# EAGLE design Triggy 0.1 (EAGLE 7.4.0)
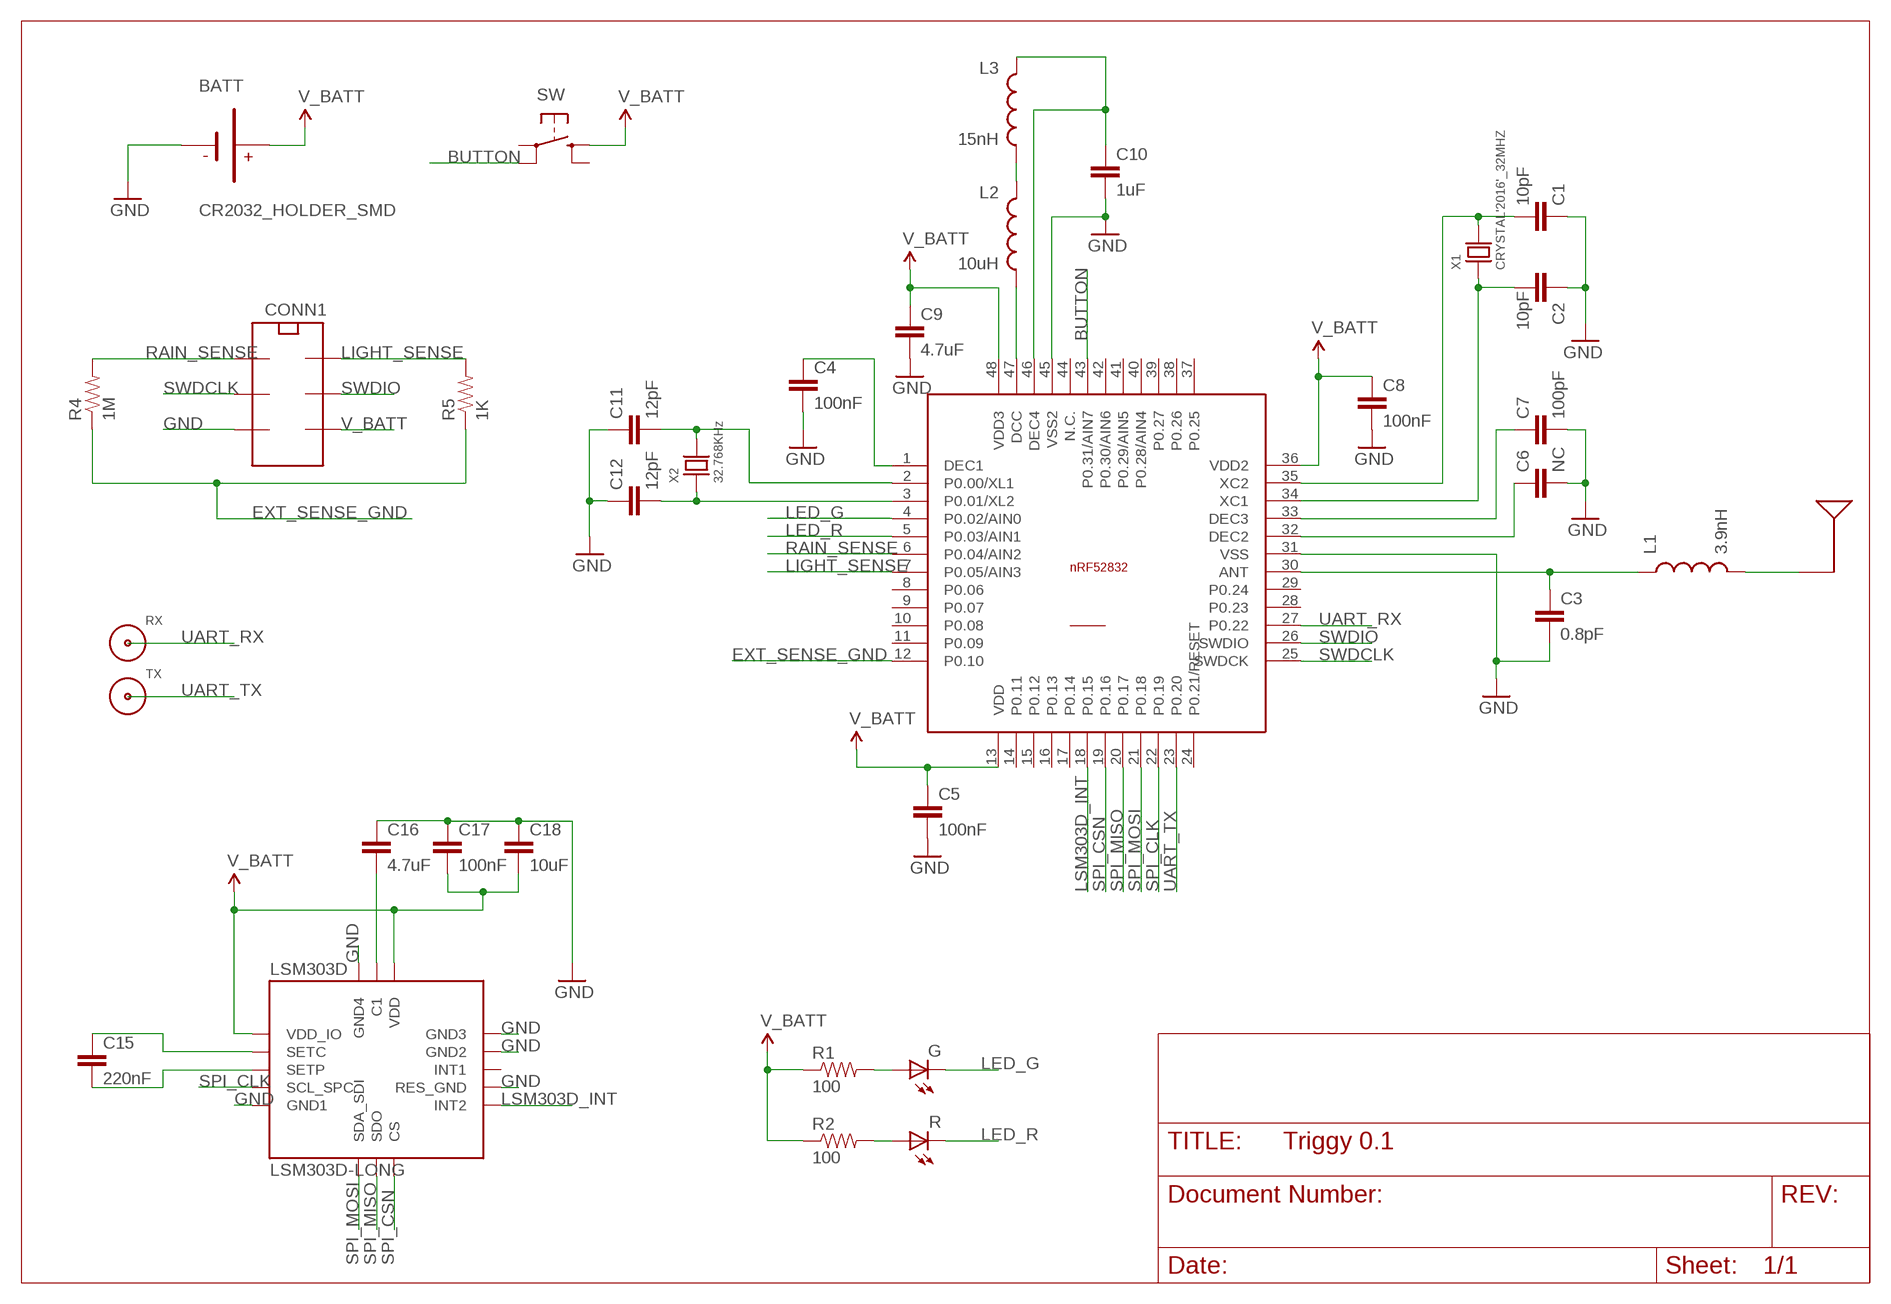
[diagram p0: schematic, sheet 1]

## Parts
ANT  ANTENNA_2450AT43A100  [ANTENNA-SMD-7MM]
BATT  CR2032_HOLDER_SMD  [CR2032_HOLDER_SMD]
C1  10pF  CAP0402-CAP  [0402-CAP]
C2  10pF  CAP0402-CAP  [0402-CAP]
C3  0.8pF  CAP0402-CAP  [0402-CAP]
C4  100nF  CAP0402-CAP  [0402-CAP]
C5  100nF  CAP0402-CAP  [0402-CAP]
C6  NC  CAP0402-CAP  [0402-CAP]
C7  100pF  CAP0402-CAP  [0402-CAP]
C8  100nF  CAP0402-CAP  [0402-CAP]
C9  4.7uF  CAP0603-CAP  [0603-CAP]
C10  1uF  CAP0603-CAP  [0603-CAP]
C11  12pF  CAP0402-CAP  [0402-CAP]
C12  12pF  CAP0402-CAP  [0402-CAP]
C15  220nF  CAP0402-CAP  [0402-CAP]
C16  4.7uF  CAP0603-CAP  [0603-CAP]
C17  100nF  CAP0402-CAP  [0402-CAP]
C18  10uF  CAP0603-CAP  [0603-CAP]
CONN1  MOLEX_8734006XX  [MOLEX_8734006XX]
L1  3.9nH  INDUCTOR0402  [C0402]
L2  10uH  INDUCTOR0603  [0603]
L3  15nH  INDUCTOR0402  [C0402]
LEDS  LED-R-G  [LED-RG-SMD-3X2.5MM]
LSM303D  LSM303D-LONG  [LGA-16-LONG]
NRF52832  NRF52832_QFN  [QFN48]
R1  100  RESISTOR0402  [0402-RES]
R2  100  RESISTOR0402  [0402-RES]
R4  1M  RESISTOR0402  [0402-RES]
R5  1K  RESISTOR0402  [0402-RES]
RX  SINGLE_CONN  [SINGLE-CONN]
SW  SWITCH-PANASONIC  [SWITCH-PANASONIC]
TX  SINGLE_CONN  [SINGLE-CONN]
X1  CRYSTAL'2016'_32MHZ  [X4-SMD-2.0X1.6MM]
X2  32.768KHz  CRYSTAL'3215'  [X2-SMD-3.2X1.5MM]

## Nets
BUTTON: NRF52832.43(P0.31/AIN7) SW.A'
EXT_SENSE_GND: NRF52832.12(P0.10) R4.1 R5.1
GND: BATT.- C1.1 C2.1 C3.2 C4.2 C5.2 C6.2 C7.2 C8.2 C9.2 C10.2 C11.1 C12.1 C16.1 C17.1 C18.1 CONN1.P$5 LSM303D.5(GND1) LSM303D.10(RES_GND) LSM303D.12(GND2) LSM303D.13(GND3) LSM303D.16(GND4) NRF52832.31(VSS) NRF52832.45(VSS2)
LED_G: LEDS.P$4(P4) NRF52832.4(P0.02/AIN0)
LED_R: LEDS.P$2(P2) NRF52832.5(P0.03/AIN1)
LIGHT_SENSE: CONN1.P$2 NRF52832.7(P0.05/AIN3) R5.2
LSM303D_INT: LSM303D.9(INT2) NRF52832.18(P0.15)
N$2: C3.1 L1.1 NRF52832.30(ANT)
N$3: ANT.1 L1.2
N$4: C1.2 NRF52832.35(XC2) X1.4
N$5: C7.1 NRF52832.33(DEC3)
N$6: C4.1 NRF52832.1(DEC1)
N$7: C2.2 NRF52832.34(XC1) X1.2
N$8: C6.1 NRF52832.32(DEC2)
N$9: L2.1 L3.2
N$10: C12.2 NRF52832.3(P0.01/XL2) X2.P$1
N$11: C11.2 NRF52832.2(P0.00/XL1) X2.P$2
N$12: L2.2 NRF52832.47(DCC)
N$15: C10.1 L3.1 NRF52832.46(DEC4)
N$24: LEDS.P$3(P3) R1.2
N$25: LEDS.P$1(P1) R2.2
N$28: C15.1 LSM303D.2(SETC)
N$29: C15.2 LSM303D.3(SETP)
N$32: C16.2 LSM303D.15(C1)
RAIN_SENSE: CONN1.P$1 NRF52832.6(P0.04/AIN2) R4.2
SPI_CLK: LSM303D.4(SCL_SPC) NRF52832.22(P0.19)
SPI_CSN: LSM303D.8(CS) NRF52832.19(P0.16)
SPI_MISO: LSM303D.7(SDO) NRF52832.20(P0.17)
SPI_MOSI: LSM303D.6(SDA_SDI) NRF52832.21(P0.18)
SWDCLK: CONN1.P$3 NRF52832.25(SWDCK)
SWDIO: CONN1.P$4 NRF52832.26(SWDIO)
UART_RX: NRF52832.27(P0.22) RX.1
UART_TX: NRF52832.23(P0.20) TX.1
V_BATT: BATT.+ BATT.+@(+) C5.1 C8.1 C9.1 C17.2 C18.2 CONN1.P$6 LSM303D.1(VDD_IO) LSM303D.14(VDD) NRF52832.13(VDD) NRF52832.36(VDD2) NRF52832.48(VDD3) R1.1 R2.1 SW.B
Unconnected: LSM303D.11(INT1) NRF52832.8(P0.06) NRF52832.9(P0.07) NRF52832.10(P0.08) NRF52832.11(P0.09) NRF52832.14(P0.11) NRF52832.15(P0.12) NRF52832.16(P0.13) NRF52832.17(P0.14) NRF52832.24(P0.21/RESET) NRF52832.28(P0.23) NRF52832.29(P0.24) NRF52832.37(P0.25) NRF52832.38(P0.26) NRF52832.39(P0.27) NRF52832.40(P0.28/AIN4) NRF52832.41(P0.29/AIN5) NRF52832.42(P0.30/AIN6) NRF52832.44(N.C.) NRF52832.GND(SLUG) SW.A SW.B'

## Library data of the parts
ANT = Triggy:ANTENNA_2450AT43A100
BATT = Watchee:CR2032_HOLDER_SMD
C1-C12 C15-C18 = SparkFun-Capacitors:CAP: Capacitor Standard 0603 ceramic capacitor, and 0.1" leaded capacitor.
CONN1 = Triggy:MOLEX_8734006XX
L1-L3 = SparkFun-Passives:INDUCTOR: Inductors Basic Inductor/Choke - 0603 and 1206. Footprints are not proven and vary greatly between part numbers. INDUCTOR POWER 3.3UH 4.0A SMD 0.197" L x 0.197" W x 0.177" H (5.00mm x 5.00mm x 4.50mm)
LEDS = Watchee:LED-R-G
LSM303D = Watchee:LSM303D-LONG
NRF52832 = NordicSemi:NRF52832_QFN
R1 R2 R4 R5 = SparkFun-Resistors:RESISTOR: Resistor Basic schematic elements and footprints for 0603, 1206, and PTH resistors.
RX TX = Watchee:SINGLE_CONN
SW = Watchee:SWITCH-PANASONIC
X1 = Triggy:CRYSTAL'2016'_32MHZ
X2 = Watchee:CRYSTAL'3215'

## Board
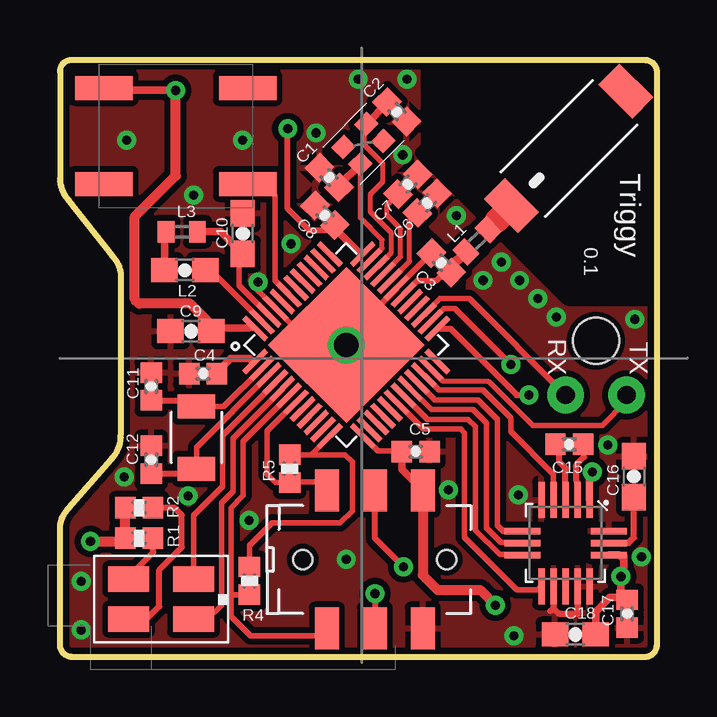
[diagram p1: board, top side]
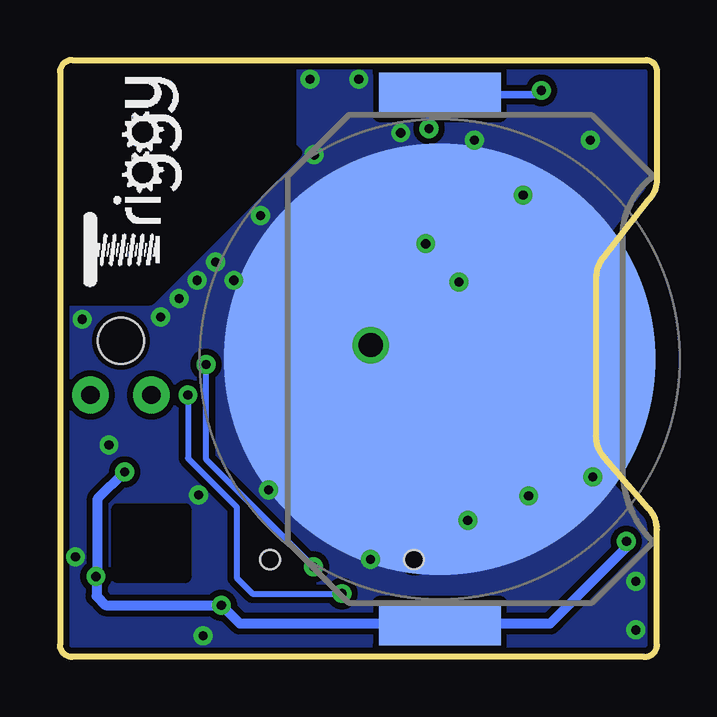
[diagram p2: board, bottom side, seen from below]

Size 24.89 x 24.89 mm. Coordinates in mm from the lower left corner, seen from the top.
Outline: 0.53,0 24.38,0 arc90 24.89,0.51 24.89,24.38 arc90 24.38,24.89 0.46,24.89 arc90 0,24.38 0,19.93 arc45 0.37,19.03 2.17,16.73 arc-45 2.54,15.83 2.54,9.26 arc-45 2.15,8.26 0.37,6.21 arc45 0,5.32 0,0.51 arc90 0.51,0
Copper layers (1*16): Top 0.035mm / dielectric 1mm / Bottom 0.035mm
Design rules "pcb_pool": minimum track width 6mil, minimum drill 8mil, track to track 6mil, track to pad 6mil, pad to pad 6mil, via to via 8mil, smd to smd 6mil, copper to edge 8mil, drill to drill 8mil, minimum pad ring 8mil, minimum via ring 8mil, stop-mask expansion 4mil, vias tented up to drill 20mil, thermal gap 10mil
Holes 1.91 mm at 22.35,13.18
tRestrict: area 15.3,21.3 to 24.9,25.4; area 21.2,14.9 to 25.2,24.5; area 15,14.9 to 28.1,28; 3 lines
bRestrict: area 21.2,14.9 to 25.2,24.5; area 15,14.9 to 28.1,28; area 15.3,21.3 to 24.9,25.4

### Footprints (pad centres in the part's own frame; a part is rotated, then mirrored left to right if it is on the bottom)
ANTENNA-SMD-7MM = smd 1.25 x 2: 1 -3.375,0; 2 3.375,0
CR2032_HOLDER_SMD = smd 1.8 x 5.08: + -11.03,0; +@ 11.03,0 | smd 18 x 18: - 0,0
0402-CAP = smd 0.85 x 0.9: 1 -0.58,0; 2 0.58,0
0603-CAP = smd 1.1 x 1: 1 -0.85,0; 2 0.85,0
MOLEX_8734006XX = smd 1 x 1.75: P$1 -2,-2.875; P$2 -2,2.875; P$3 0,-2.875; P$4 0,2.875; P$5 2,-2.875; P$6 2,2.875 | hole 0.8: -3,0; 3,0
C0402 = smd 0.7 x 0.9: 1 -0.65,0; 2 0.65,0
0603 = smd 1.1 x 1: 1 -0.85,0; 2 0.85,0
LED-RG-SMD-3X2.5MM = smd 1.7 x 1.05: P$1 1.35,0.83; P$2 -1.35,0.83; P$3 1.35,-0.83; P$4 -1.35,-0.83
LGA-16-LONG = smd 1.5 x 0.28: 1 -1.7,1.2; 2 -1.7,0.7; 3 -1.7,0.2; 4 -1.7,-0.3; 5 -1.7,-0.8; 9 1.9,-0.8; 10 1.9,-0.3; 11 1.9,0.2; 12 1.9,0.7; 13 1.9,1.2 | smd 0.28 x 1.5: 6 -0.4,-1.6; 7 0.1,-1.6; 8 0.6,-1.6; 14 0.6,2; 15 0.1,2; 16 -0.4,2
QFN48 = smd 1.3 x 0.226: 1 -3.17,2.2; 2 -3.17,1.8; 3 -3.17,1.4; 4 -3.17,1; 5 -3.17,0.6; 6 -3.17,0.2; 7 -3.17,-0.2; 8 -3.17,-0.6; 9 -3.17,-1; 10 -3.17,-1.4; 11 -3.17,-1.8; 12 -3.17,-2.2; 25 3.17,-2.2; 26 3.17,-1.8; 27 3.17,-1.4; 28 3.17,-1; 29 3.17,-0.6; 30 3.17,-0.2; 31 3.17,0.2; 32 3.17,0.6; 33 3.17,1; 34 3.17,1.4; 35 3.17,1.8; 36 3.17,2.2 | smd 0.226 x 1.3: 13 -2.2,-3.17; 14 -1.8,-3.17; 15 -1.4,-3.17; 16 -1,-3.17; 17 -0.6,-3.17; 18 -0.2,-3.17; 19 0.2,-3.17; 20 0.6,-3.17; 21 1,-3.17; 22 1.4,-3.17; 23 1.8,-3.17; 24 2.2,-3.17; 37 2.2,3.17; 38 1.8,3.17; 39 1.4,3.17; 40 1,3.17; 41 0.6,3.17; 42 0.2,3.17; 43 -0.2,3.17; 44 -0.6,3.17; 45 -1,3.17; 46 -1.4,3.17; 47 -1.8,3.17; 48 -2.2,3.17 | smd 4.6 x 4.6: GND 0,0
0402-RES = smd 0.85 x 0.9: 1 -0.58,0; 2 0.58,0
SINGLE-CONN = drill 0.762 pad 1.524: 1 0,0
SWITCH-PANASONIC = smd 2.4 x 1: A -3,-2; A' 3,-2; B -3,2; B' 3,2
X4-SMD-2.0X1.6MM = smd 0.75 x 0.7: 1 -0.675,0.5; 2 -0.675,-0.5; 3 0.675,-0.5; 4 0.675,0.5
X2-SMD-3.2X1.5MM = smd 1 x 1.55: P$1 -1.3,0; P$2 1.3,0

### Placement (x,y rotation side)
ANT  21.21,21.21 45 top
BATT  9.05,12.42 90 bottom
C1  11.23,19.99 315 top
C2  14.05,22.73 135 top
C3  15.9,16.43 135 top
C4  5.97,11.81 180 top
C5  14.83,8.56 0 top
C6  15.32,18.92 45 top
C7  14.5,19.71 45 top
C8  11.05,18.41 135 top
C9  5.46,13.59 180 top
C10  7.62,17.65 90 top
C11  3.81,11.28 270 top
C12  3.81,8.23 270 top
C15  21.23,8.86 180 top
C16  23.93,7.52 270 top
C17  23.65,1.8 90 top
C18  21.49,0.94 0 top
CONN1  13.13,4.06 0 top
L1  17.39,17.35 45 top
L2  5.21,16.13 0 top
L3  5.08,17.73 180 top
LEDS  4.22,2.41 180 top
LSM303D  20.88,4.85 270 top
NRF52832  11.94,13 45 top
R1  3.3,4.95 0 top
R2  3.3,6.22 0 top
R4  7.9,3.17 270 top
R5  9.58,7.85 270 top
RX  21.08,10.92 90 top
SW  4.83,21.72 0 top
TX  23.62,10.92 90 top
X1  12.65,21.39 225 top
X2  5.69,9.14 90 top

### Tracks (layer width: path | path; a pad name or v marks a point on that pad's centre or on a via)
BUTTON
  Top 0.229: NRF52832.43 8.97,15.7 8.97,19.23 8.64,19.56 7.99,19.56 SW.A'
EXT_SENSE_GND
  Top 0.229: NRF52832.12 10.47,8.43 R5.1 11.89,8.43 12.19,8.13 12.19,6.1 11.68,5.59 8.84,5.59 7.9,4.65 R4.1
GND  (via drill 0.38, 1.02)
  Top 0.203: NRF52832.45 10.36,13.16 11.79,13.16 v11.94,13.01 12.55,13.61 12.57,13.92
  Top 0.229: 12.57,13.92 NRF52832.31 C3.2 | 8.26,15.26 v8.26,15.63 8.26,15.28 8.97,14.58
  Top 0.254: LSM303D.12 21.58,1.79 21.59,1.78 20.83,1.78 20.57,2.03 | 20.57,2.79 20.57,2.03 | 20.57,2.03 20.45,1.91
  other vias: 18.92,0.89 22.85,8.85 19.12,6.76 24.25,4.17 0.88,3.16 0.88,1.12 11.94,4.06 2.68,7.5 18.41,16.47 17.64,15.7 19.17,15.7 19.93,14.94 20.69,14.18 16.53,18.4 14.29,20.94 14.47,24.09 12.44,24.09 10.68,21.85 7.61,21.55 2.78,21.55 9.64,17.23 5.35,6.71 5.58,19.26 16.2,6.97 23.97,14.08 7.89,5.7
  pour Bottom (isolate 0.254, no thermals): 0,24.9 24.89,24.89 24.9,17.5 24.89,0 0,0 0,5.59 2.51,8.81 2.59,16.08 0,19.15
  pour Top (isolate 0.254): 0,24.91 24.89,24.89 24.89,0.01 0,0 0,5.59 2.51,8.86 2.51,16.18 0,19.15
LED_G
  Top 0.229: NRF52832.4 8.99,11.45 6.78,9.25 6.78,7.11 5.56,5.89 LEDS.P$4
LED_R
  Top 0.229: NRF52832.5 9.27,11.18 7.21,9.12 7.21,6.91 6.73,6.43 6.73,2.16 6.1,1.52 5.63,1.52 LEDS.P$2
LIGHT_SENSE
  Top 0.229: CONN1.P$2 10.78,7.29 9.6,7.29 R5.2 8.99,7.27 8.64,7.62 8.64,9.42 NRF52832.7
LSM303D_INT
  Top 0.229: NRF52832.18 15.16,9.5 16.71,9.5 16.87,9.35 16.87,4.98 19.05,2.79 19.92,2.79 LSM303D.9
N$2
  Top 0.229: 15.85,15.85 16.14,15.85 C3.1 | NRF52832.30 14.91,15.7
  Top 0.254: 15.85,15.85 15.7,15.7 14.91,15.7
  Top 0.406: C3.1 16.31,16.27 L1.1
N$3
  Top 0.406: 18.21,18.19 L1.2
  Top 1.016: ANT.1 18.21,18.19
N$4
  Top 0.203: NRF52832.35 13.44,17.04 13.44,17.4 12.53,18.31 X1.4
  Top 0.305: C1.2 11.64,19.67 X1.4
N$5
  Top 0.203: NRF52832.33 13.47,15.96 14.2,16.69 14.2,17.86 13.64,18.41 13.64,18.85 C7.1
N$6
  Top 0.229: NRF52832.1 8.03,12.32 8,12.34
  Top 0.305: 8,12.34 7.9,12.45 7.11,12.45 6.55,11.88 C4.1
N$7
  Top 0.203: X1.2 12.7,22.14 12.7,21.34 13.46,20.57 13.46,19.81 12.95,19.3 12.95,18.54 13.82,17.68 13.82,16.87 NRF52832.34
  Top 0.305: C2.2 13.64,23.08 X1.2
N$8
  Top 0.203: C6.1 14.58,18.19 14.58,16.5 NRF52832.32
N$9
  Top 0.305: L2.1 4.36,17.4 L3.2
N$10
  Top 0.229: NRF52832.3 5.69,8.74 X2.P$1
  Top 0.254: C12.2 5.5,7.65 X2.P$1
N$11
  Top 0.229: NRF52832.2 6.83,10.44 X2.P$2
  Top 0.254: C11.2 5.44,10.7 X2.P$2
N$12
  Top 0.229: 6.11,15.82 L2.2 6.31,15.88 6.53,15.88 NRF52832.47
N$15
  Top 0.229: NRF52832.46 7.47,15.49 7.47,16.65 C10.1
  Top 0.305: L3.1 6.69,17.73 C10.1
N$24
  Top 0.254: LEDS.P$3 2.87,3.35 3.89,4.37 R1.2
N$25
  Top 0.254: LEDS.P$1 3.62,1.58 4.14,2.11 4.14,3.63 5.08,4.57 5.08,5.92 4.78,6.22 R2.2
N$28
  Top 0.254: LSM303D.2 21.58,7.28 21.54,7.32 21.54,8.03 21.84,8.33 21.84,8.84 C15.1
N$29
  Top 0.254: LSM303D.3 21.08,7.88 20.83,8.13 20.83,8.69 C15.2
N$32
  Top 0.254: LSM303D.15 23.7,4.75 23.93,4.98 C16.2
RAIN_SENSE
  Top 0.229: NRF52832.6 7.65,8.99 7.65,6.73 7.14,6.22 7.14,2.54 | 10.83,0.89 7.95,0.89 7.14,1.7 7.14,2.54 | R4.2 7.19,2.6 7.14,2.54
  Top 0.254: 10.83,0.89 CONN1.P$1
SPI_CLK
  Top 0.229: NRF52832.22 15.8,11.12 17.63,11.12 18.8,9.96 18.8,9.4 20.57,7.62 LSM303D.4
SPI_CSN
  Top 0.229: NRF52832.19 15.32,9.91 17.02,9.91 17.32,9.6 17.32,5.28 18.34,4.27 19.26,4.27 LSM303D.8
SPI_MISO
  Top 0.229: NRF52832.20 15.48,10.31 17.22,10.31 17.78,9.75 17.78,5.38 18.39,4.78 19.26,4.78 LSM303D.7
SPI_MOSI
  Top 0.229: NRF52832.21 15.64,10.72 17.42,10.72 18.24,9.91 18.24,5.49 18.49,5.23 19.26,5.23 LSM303D.6
SWDCLK  (via drill 0.38)
  Top 0.229: CONN1.P$3 13.08,1.14
  Top 0.254: v13.13,2.64 CONN1.P$3 | CONN1.P$3 13.13,0.69 12.95,0.51 12.95,1.01 CONN1.P$3 | NRF52832.25 16.28,13.69 19.05,10.92 v19.56,10.92
  Bottom 0.254: v19.56,10.92 19.56,8.28 17.53,6.25 17.53,3.3 16.87,2.64 v13.13,2.64
SWDIO  (via drill 0.38)
  Top 0.229: NRF52832.26 16,14.53 16.46,14.53 v18.8,12.19
  Top 0.254: v14.33,3.76 13.13,4.95 CONN1.P$4
  Bottom 0.254: v14.33,3.76 18.8,8.23 v18.8,12.19
UART_RX
  Top 0.229: NRF52832.27 15.85,14.94 17.07,14.94 RX.1
UART_TX
  Top 0.203: 15.96,11.53 15.98,11.51 17.86,11.51 19.71,9.65
  Top 0.229: TX.1 23.62,10.67 22.61,9.65 19.71,9.65 | NRF52832.23 15.96,11.53
V_BATT  (via drill 0.38)
  Top 0.229: NRF52832.36 12.57,16.76 12.5,16.84 | 7.87,13.72 7.9,13.69 NRF52832.48 | NRF52832.13 12.64,9.21 13.26,8.59 14.23,8.59 C5.1
  Top 0.254: v9.5,22.02 9.5,18.69 10.41,17.78 11.36,17.78 11.46,17.88 | C8.1 11.62,17.84 11.62,17.72
  Top 0.305: 23.62,2.43 C17.2 | 23.52,4.22 23.52,4.06 | 23.52,4.06 23.52,3.48 v23.39,3.35 23.39,2.64 C17.2 | C18.2 22.34,1.89 22.92,2.48 23.55,2.48 C17.2 | LSM303D.14 23.33,4.25 23.52,4.06 | LSM303D.1 22.08,7.6 v22.2,7.72 | 12.5,16.84 11.62,17.72 11.46,17.88 | v4.83,23.62 1.92,23.62 SW.B | 7.87,13.72 6.44,13.72 C9.1 | CONN1.P$6 14.25,7.82 C5.1
  Top 0.406: 23.58,2.29 C17.2 | CONN1.P$6 15.13,3.41 15.75,2.79 17.53,2.79 v18.16,2.16 | v4.83,23.62 4.83,20.07 3.12,18.36 3.12,14.91 3.3,14.73 5.42,14.73 6.44,13.72 | v1.27,4.83 2.6,4.83 R1.1 R2.1
  Bottom 0.254: v9.5,22.02 9.5,22.68 9.65,22.84 BATT.+@
  Bottom 0.305: BATT.+@ 5,23.45 v4.83,23.62
  Bottom 0.406: 11.04,1.39 BATT.+ 9.66,1.4 | 9.66,1.4 17.4,1.4 v18.16,2.16 22.99,2.16 23.37,2.54 23.37,3.33 v23.39,3.35 23.32,3.35 23.32,6.6 v22.2,7.72 | 9.66,1.4 4.45,1.4 1.27,4.57 v1.27,4.83

### Text on the board
tPlace: Triggy | 0.1
200bmp: D:/Mes Documents/Watchee 0.1 Board/logo_pcb_small.bmp